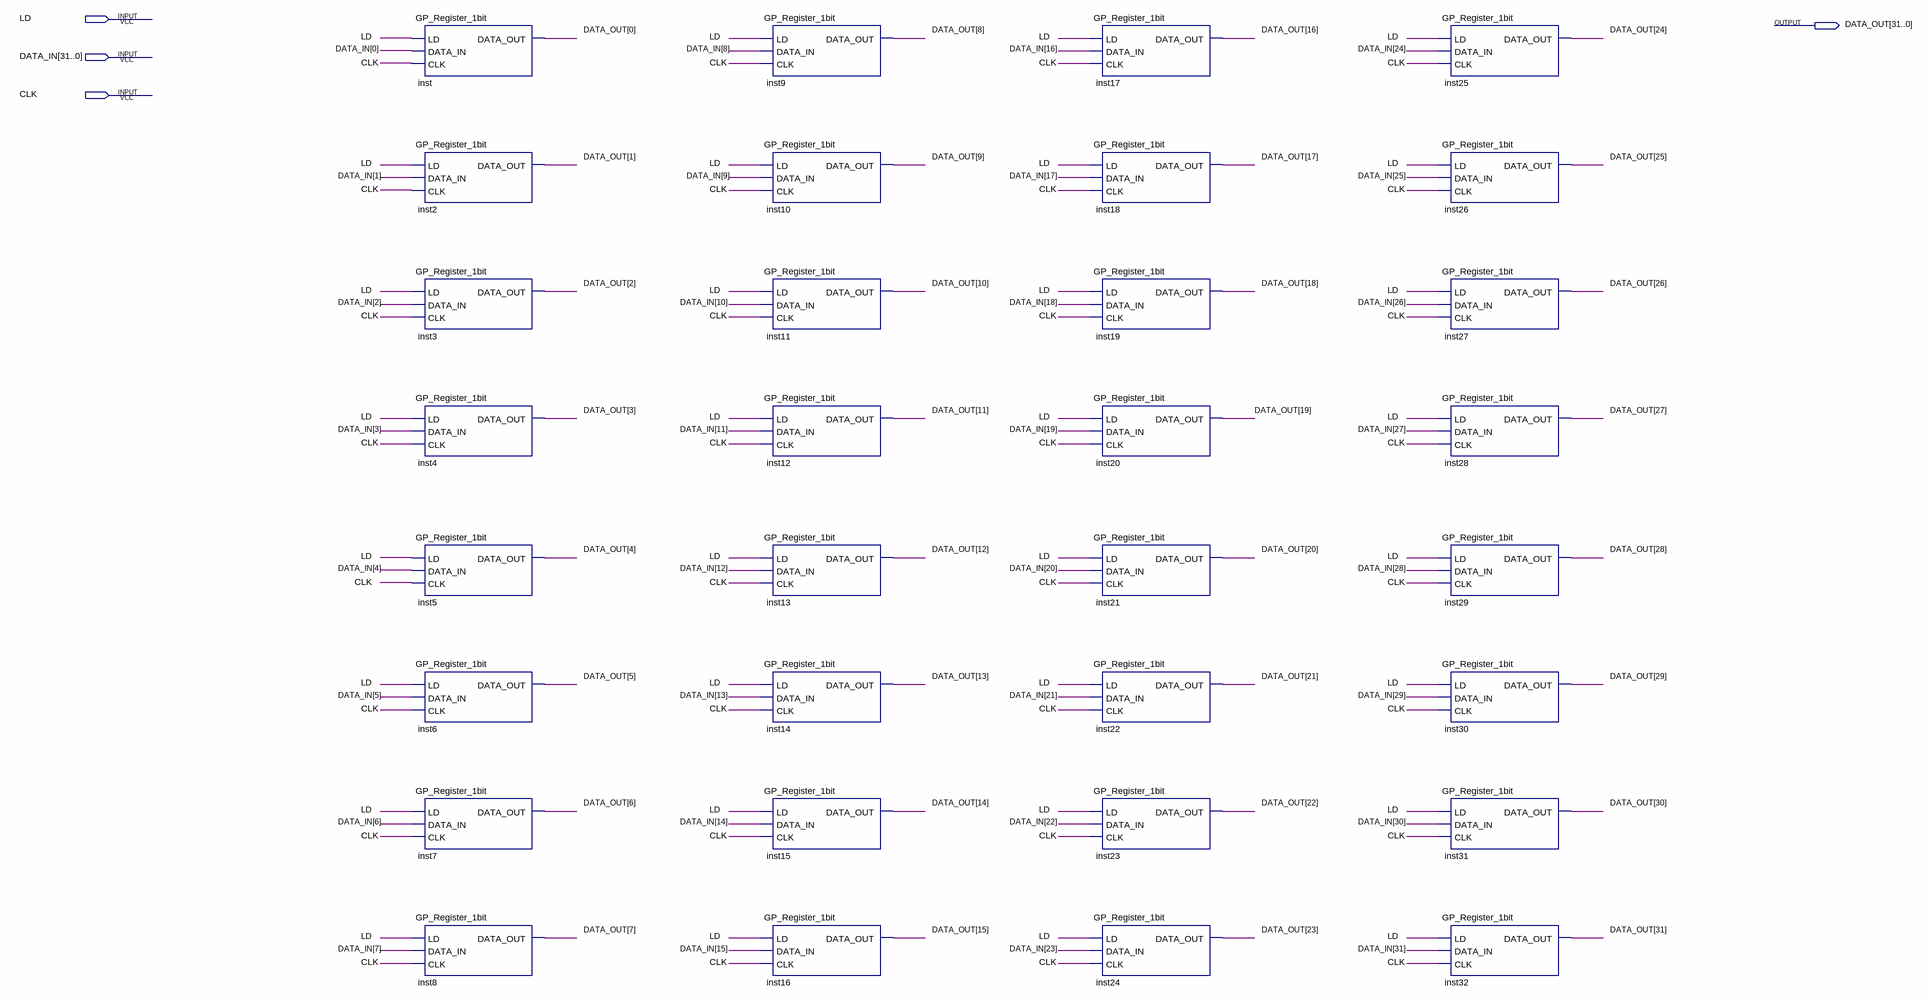
[diagram p0: schematic sheet]
// Quartus schematic GP_Register.bdf as structural Verilog: 32 symbols, 4 pins
module GP_Register (
  input  LD,
  input  [31:0] DATA_IN,
  input  CLK,
  output [31:0] DATA_OUT
);

  GP_Register_1bit inst (.LD(LD), .DATA_IN(DATA_IN[0]), .CLK(CLK), .DATA_OUT(DATA_OUT[0]));
  GP_Register_1bit inst2 (.LD(LD), .DATA_IN(DATA_IN[1]), .CLK(CLK), .DATA_OUT(DATA_OUT[1]));
  GP_Register_1bit inst3 (.LD(LD), .DATA_IN(DATA_IN[2]), .CLK(CLK), .DATA_OUT(DATA_OUT[2]));
  GP_Register_1bit inst4 (.LD(LD), .DATA_IN(DATA_IN[3]), .CLK(CLK), .DATA_OUT(DATA_OUT[3]));
  GP_Register_1bit inst5 (.LD(LD), .DATA_IN(DATA_IN[4]), .CLK(CLK), .DATA_OUT(DATA_OUT[4]));
  GP_Register_1bit inst6 (.LD(LD), .DATA_IN(DATA_IN[5]), .CLK(CLK), .DATA_OUT(DATA_OUT[5]));
  GP_Register_1bit inst7 (.LD(LD), .DATA_IN(DATA_IN[6]), .CLK(CLK), .DATA_OUT(DATA_OUT[6]));
  GP_Register_1bit inst8 (.LD(LD), .DATA_IN(DATA_IN[7]), .CLK(CLK), .DATA_OUT(DATA_OUT[7]));
  GP_Register_1bit inst9 (.LD(LD), .DATA_IN(DATA_IN[8]), .CLK(CLK), .DATA_OUT(DATA_OUT[8]));
  GP_Register_1bit inst10 (.LD(LD), .DATA_IN(DATA_IN[9]), .CLK(CLK), .DATA_OUT(DATA_OUT[9]));
  GP_Register_1bit inst11 (.LD(LD), .DATA_IN(DATA_IN[10]), .CLK(CLK), .DATA_OUT(DATA_OUT[10]));
  GP_Register_1bit inst12 (.LD(LD), .DATA_IN(DATA_IN[11]), .CLK(CLK), .DATA_OUT(DATA_OUT[11]));
  GP_Register_1bit inst13 (.LD(LD), .DATA_IN(DATA_IN[12]), .CLK(CLK), .DATA_OUT(DATA_OUT[12]));
  GP_Register_1bit inst14 (.LD(LD), .DATA_IN(DATA_IN[13]), .CLK(CLK), .DATA_OUT(DATA_OUT[13]));
  GP_Register_1bit inst15 (.LD(LD), .DATA_IN(DATA_IN[14]), .CLK(CLK), .DATA_OUT(DATA_OUT[14]));
  GP_Register_1bit inst16 (.LD(LD), .DATA_IN(DATA_IN[15]), .CLK(CLK), .DATA_OUT(DATA_OUT[15]));
  GP_Register_1bit inst17 (.LD(LD), .DATA_IN(DATA_IN[16]), .CLK(CLK), .DATA_OUT(DATA_OUT[16]));
  GP_Register_1bit inst18 (.LD(LD), .DATA_IN(DATA_IN[17]), .CLK(CLK), .DATA_OUT(DATA_OUT[17]));
  GP_Register_1bit inst19 (.LD(LD), .DATA_IN(DATA_IN[18]), .CLK(CLK), .DATA_OUT(DATA_OUT[18]));
  GP_Register_1bit inst20 (.LD(LD), .DATA_IN(DATA_IN[19]), .CLK(CLK), .DATA_OUT(DATA_OUT[19]));
  GP_Register_1bit inst21 (.LD(LD), .DATA_IN(DATA_IN[20]), .CLK(CLK), .DATA_OUT(DATA_OUT[20]));
  GP_Register_1bit inst22 (.LD(LD), .DATA_IN(DATA_IN[21]), .CLK(CLK), .DATA_OUT(DATA_OUT[21]));
  GP_Register_1bit inst23 (.LD(LD), .DATA_IN(DATA_IN[22]), .CLK(CLK), .DATA_OUT(DATA_OUT[22]));
  GP_Register_1bit inst24 (.LD(LD), .DATA_IN(DATA_IN[23]), .CLK(CLK), .DATA_OUT(DATA_OUT[23]));
  GP_Register_1bit inst25 (.LD(LD), .DATA_IN(DATA_IN[24]), .CLK(CLK), .DATA_OUT(DATA_OUT[24]));
  GP_Register_1bit inst26 (.LD(LD), .DATA_IN(DATA_IN[25]), .CLK(CLK), .DATA_OUT(DATA_OUT[25]));
  GP_Register_1bit inst27 (.LD(LD), .DATA_IN(DATA_IN[26]), .CLK(CLK), .DATA_OUT(DATA_OUT[26]));
  GP_Register_1bit inst28 (.LD(LD), .DATA_IN(DATA_IN[27]), .CLK(CLK), .DATA_OUT(DATA_OUT[27]));
  GP_Register_1bit inst29 (.LD(LD), .DATA_IN(DATA_IN[28]), .CLK(CLK), .DATA_OUT(DATA_OUT[28]));
  GP_Register_1bit inst30 (.LD(LD), .DATA_IN(DATA_IN[29]), .CLK(CLK), .DATA_OUT(DATA_OUT[29]));
  GP_Register_1bit inst31 (.LD(LD), .DATA_IN(DATA_IN[30]), .CLK(CLK), .DATA_OUT(DATA_OUT[30]));
  GP_Register_1bit inst32 (.LD(LD), .DATA_IN(DATA_IN[31]), .CLK(CLK), .DATA_OUT(DATA_OUT[31]));
endmodule
